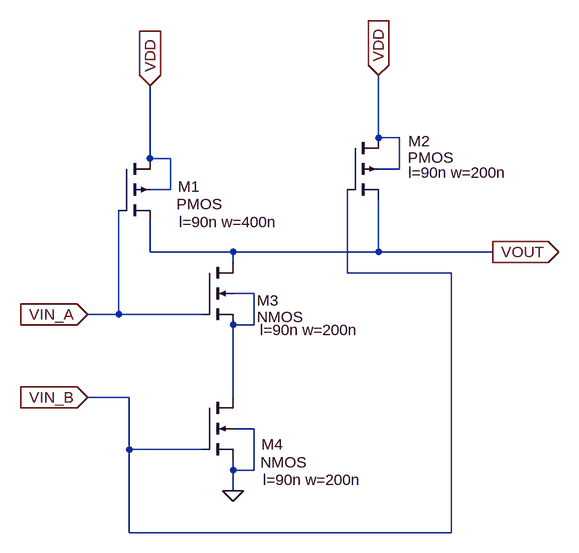
[diagram p0: schematic nand.asc]
nand.asc, the LTspice schematic file:
Version 4
SHEET 1 880 680
WIRE 336 32 336 -64
WIRE 368 32 336 32
WIRE -16 64 -16 -48
WIRE 16 64 -16 64
WIRE -16 80 -16 64
WIRE 368 80 368 32
WIRE 368 80 336 80
WIRE 16 112 16 64
WIRE 16 112 -16 112
WIRE -16 208 -16 160
WIRE 112 208 -16 208
WIRE 336 208 336 128
WIRE 336 208 112 208
WIRE 512 208 336 208
WIRE 112 224 112 208
WIRE 288 240 288 112
WIRE 448 240 288 240
WIRE 144 272 112 272
WIRE -64 304 -64 144
WIRE -64 304 -112 304
WIRE 64 304 -64 304
WIRE 144 320 144 272
WIRE 144 320 112 320
WIRE -48 432 -112 432
WIRE 112 432 112 320
WIRE 144 480 112 480
WIRE -48 512 -48 432
WIRE 64 512 -48 512
WIRE 112 544 112 528
WIRE 144 544 144 480
WIRE 144 544 112 544
WIRE 112 576 112 544
WIRE -48 640 -48 512
WIRE 448 640 448 240
WIRE 448 640 -48 640
FLAG -112 304 VIN_A
IOPIN -112 304 In
FLAG 512 208 VOUT
IOPIN 512 208 Out
FLAG -16 -48 VDD
IOPIN -16 -48 In
FLAG 336 -64 VDD
IOPIN 336 -64 In
FLAG 112 576 0
FLAG -112 432 VIN_B
IOPIN -112 432 In
SYMBOL pmos4 -64 64 R0
WINDOW 0 91 43 Left 2
WINDOW 3 89 70 Left 2
WINDOW 123 93 98 Left 2
SYMATTR InstName M1
SYMATTR Value2 l=90n w=400n
SYMBOL pmos4 288 32 R0
WINDOW 0 94 5 Left 2
WINDOW 3 93 31 Left 2
WINDOW 123 94 54 Left 2
SYMATTR InstName M2
SYMATTR Value2 l=90n w=200n
SYMBOL nmos4 64 224 R0
WINDOW 0 85 59 Left 2
WINDOW 3 85 84 Left 2
WINDOW 123 89 104 Left 2
SYMATTR InstName M3
SYMATTR Value2 l=90n w=200n
SYMBOL nmos4 64 432 R0
WINDOW 0 92 72 Left 2
WINDOW 3 90 100 Left 2
WINDOW 123 94 127 Left 2
SYMATTR InstName M4
SYMATTR Value2 l=90n w=200n

The netlist it stands for:
* nand.asc
M1 VDD VIN_A VOUT VDD PMOS l=90n w=400n
M2 VDD VIN_B VOUT VDD PMOS l=90n w=200n
M3 VOUT VIN_A N001 N001 NMOS l=90n w=200n
M4 N001 VIN_B 0 0 NMOS l=90n w=200n
.model NMOS NMOS
.model PMOS PMOS
.lib standard.mos
.backanno
.end